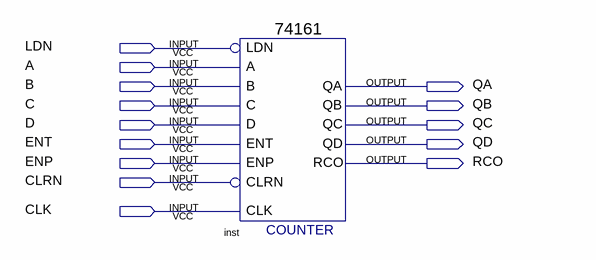
[diagram p0: schematic sheet]
// Quartus schematic Ckt74161.bdf as structural Verilog: 1 symbols, 14 pins
module Ckt74161 (
  input  LDN,
  input  A,
  input  B,
  input  C,
  input  D,
  input  ENT,
  input  ENP,
  input  CLRN,
  input  CLK,
  output QA,
  output QB,
  output QC,
  output QD,
  output RCO
);

  \74161  inst (
    .CLRN(CLRN), .CLK(CLK), .ENP(ENP), .LDN(LDN), .A(A), .D(D), .ENT(ENT), .B(B), .C(C), .QD(QD), .QC(QC),
    .QB(QB), .QA(QA), .RCO(RCO));
endmodule
